# EAGLE design CtrlBoard (EAGLE 6.3)
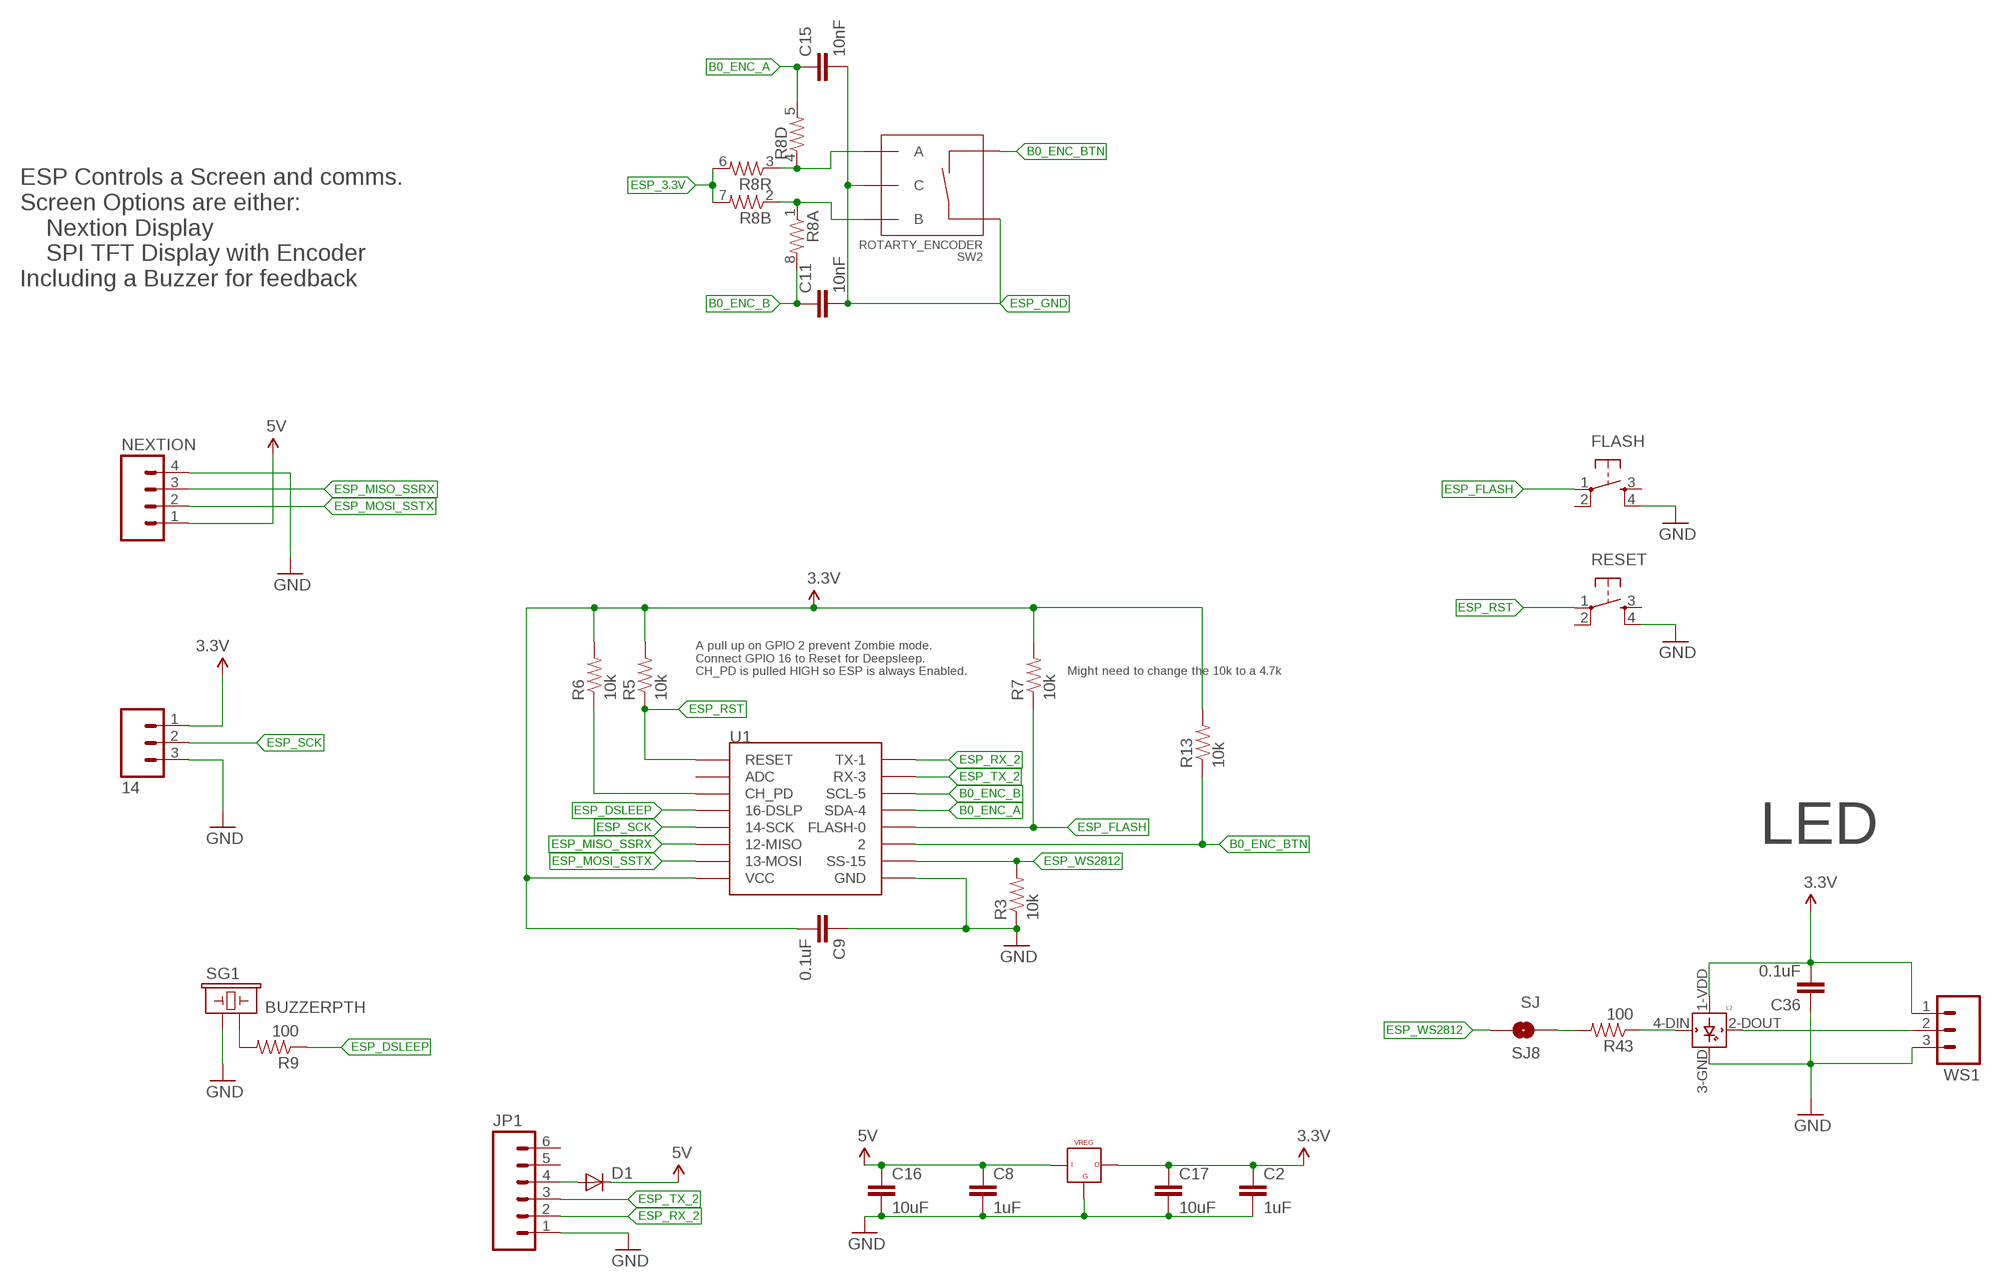
[diagram p0: schematic, sheet 1]

## Parts
14  M03PTH  [1X03]
C2  1uF  CAP0805  [0805]
C8  1uF  CAP0805  [0805]
C9  0.1uF  CAP0805  [0805]
C11  10nF  CAP0805  [0805]
C15  10nF  CAP0805  [0805]
C16  10uF  CAP0805  [0805]
C17  10uF  CAP0805  [0805]
C36  0.1uF  CAP0805  [0805]
D1  DIODESOD  [SOD-323]
FLASH  TAC_SWITCHSMD  [TACTILE_SWITCH_SMD]
JP1  M06SILK_FEMALE_PTH  [1X06]
L2  WS2812B  [WS2812B]
NEXTION  M041X04_NO_SILK  [1X04_NO_SILK]
R3  10k  RESISTOR0805  [0805]
R5  10k  RESISTOR0805  [0805]
R6  10k  RESISTOR0805  [0805]
R7  10k  RESISTOR0805  [0805]
R8  RESISTOR-ARRAY0603-ARV  [0603-ARV]
R9  100  RESISTOR0805  [0805]
R13  10k  RESISTOR0805  [0805]
R43  100  RESISTOR0805  [0805]
RESET  TAC_SWITCHSMD  [TACTILE_SWITCH_SMD]
SG1  BUZZERPTH  [BUZZER-12MM]
SJ8  SJ  SOLDERJUMPERNO  [SJ_2S-NO]
SW2  ROTARTY_ENCODER  [ROTARY_ENC_PLAIN]
U1  ESP12SMD  [ESP12-SMD]
U$3  VREG_3V3  [DPACK]
WS1  M03PTH  [1X03]

## Nets
B0_ENC_A: C15.1 R8.5 U1.GPIO4(SDA-4)
B0_ENC_B: C11.1 R8.8 U1.GPIO5(SCL-5)
B0_ENC_BTN: R13.1 SW2.SW- U1.GPIO2
ESP_3.3V: 14.1 C2.1 C9.2 C17.1 C36.2 L2.1-VDD(VDD) R5.2 R6.2 R7.2 R8.6 R8.7 R13.2 U1.VCC U$3.2 WS1.1 ; supply symbol labelled 3.3V
ESP_5V: C8.1 C16.1 D1.1(C) NEXTION.1 U$3.3 ; supply symbol labelled 5V
ESP_DSLEEP: R9.1 U1.GPIO16(16-DSLP)
ESP_FLASH: FLASH.1 R7.1 U1.GPIO0(FLASH-0)
ESP_GND: 14.3 C2.2 C8.2 C9.1 C11.2 C15.2 C16.2 C17.2 C36.1 FLASH.4 JP1.1 L2.3-GND(GND) NEXTION.4 R3.1 RESET.4 SG1.+ SW2.C SW2.SW+ U1.GND U$3.1 WS1.3 ; supply symbol labelled GND
ESP_MISO_SSRX: NEXTION.3 U1.GPIO12(12-MISO)
ESP_MOSI_SSTX: NEXTION.2 U1.GPIO13(13-MOSI)
ESP_RST: R5.1 RESET.1 U1.RESET
ESP_RX_2: JP1.2 U1.TXD0(TX-1)
ESP_SCK: 14.2 U1.GPIO14(14-SCK)
ESP_TX_2: JP1.3 U1.RXD0(RX-3)
ESP_WS2812: R3.2 SJ8.2 U1.GPIO15(SS-15)
N$1: R6.1 U1.CH_PD
N$4: D1.2(A) JP1.4
N$5: R8.1 R8.2 SW2.B
N$6: R9.2 SG1.-
N$7: R8.3 R8.4 SW2.A
N$74: L2.4-DIN(DIN) R43.1
N$75: L2.2-DOUT(DOUT) WS1.2
N$76: R43.2 SJ8.1
Unconnected: FLASH.2 FLASH.3 JP1.5 JP1.6 RESET.2 RESET.3 U1.ADC

## Notes on the sheet
- ESP Controls a Screen and comms.
  Screen Options are either:
      Nextion Display
      SPI TFT Display with Encoder
  Including a Buzzer for feedback
- A pull up on GPIO 2 prevent Zombie mode.
  Connect GPIO 16 to Reset for Deepsleep.
  CH_PD is pulled HIGH so ESP is always Enabled.
- Might need to change the 10k to a 4.7k
- LED

## Library data of the parts
14 WS1 = SparkFun-Connectors:M03: Header 3 Standard 3-pin 0.1" header. Use with straight break away headers (SKU : PRT-00116), right angle break away headers (PRT-00553), swiss pins (PRT-00743), machine pins (PRT-00117), and female headers (PRT-00115). Molex polarized connector foot print use with SKU : PRT-08232 with associated crimp pins and housings.
C2 C8 C9 C11 C15-C17 C36 = SparkFun-Capacitors:CAP: Capacitor Standard 0603 ceramic capacitor, and 0.1" leaded capacitor.
D1 = SparkFun-DiscreteSemi:DIODE: Diode These are standard reverse protection diodes and small signal diodes. SMA package can handle up to about 1A. SOD-323 can handle about 200mA. What the SOD-323 package when ordering, there are some mfgs out there that are 5-pin packages.; PROD_ID: DIO-09646
FLASH RESET = SparkFun-Electromechanical:TAC_SWITCH: Momentary Switch Button commonly used for reset or general input. Spark Fun Electronics SKU : COM-00097 SMT- SWCH-08247; PROD_ID: SWCH-08247
JP1 = SparkFun-Connectors:M06: Header 6 Standard 6-pin 0.1" header. Use with straight break away headers (SKU : PRT-00116), right angle break away headers (PRT-00553), swiss pins (PRT-00743), machine pins (PRT-00117), and female headers (PRT-00115). Molex polarized connector foot print use with SKU : PRT-08094 with associated crimp pins and housings. NOTES ON THE VARIANTS LOCK and LOCK_LONGPADS... This footprint was designed to help hold the alignment of a through-hole component (i.e. 6-pin header) while soldering it into place. You may notice that each hole has been shifted either up or down by 0.005 of an inch from it's more standard position (which is a perfectly straight line). This slight alteration caused the pins (the squares in the middle) to touch the edges of the holes. Because they are alternating, it causes a "brace" to hold the component in place. 0.005 has proven to be the perfect amount of "off-center" position when using our standard breakaway headers. Although looks a little odd when you look at the bare footprint, once you have a header in there, the alteration is very hard to notice. Also,if you push a header all the way into place, it is covered up entirely on the bottom side. This idea of altering the position of holes to aid alignment will be further integrated into the Sparkfun Library for other footprints. It can help hold any component with 3 or more connection pins.; PROD_ID: CONN-08437
L2 = adafruit:WS2812B
NEXTION = SparkFun-Connectors:M04: Header 4 Standard 4-pin 0.1" header. Use with straight break away headers (SKU : PRT-00116), right angle break away headers (PRT-00553), swiss pins (PRT-00743), machine pins (PRT-00117), and female headers (PRT-00115). Molex polarized connector foot print use with SKU : PRT-08231 with associated crimp pins and housings. 1MM SMD Version SKU: PRT-10208
R3 R5-R7 R9 R13 R43 = LowPowerLab:RESISTOR: Resistor Basic schematic elements and footprints for 0603, 1206, and PTH resistors.
R8 = SparkFun-Resistors:RESISTOR-ARRAY: Array Chip Resistor Source: RS Component / Phycomp
SG1 = SparkFun-Electromechanical:BUZZER: Buzzer 12mm Spark Fun Electronics SKU : Comp-Buzzer
SJ8 = SparkFun-Passives:SOLDERJUMPER: Solder Jumper Standard SMD solder jumper. Used to automate production. Two varients : Normally Open and Normally Closed are the same, but have different paste layers. NC will have a large amount of paste and should jumper during reflow.
SW2 = SparkFun-Electromechanical:ROTARTY_ENCODER: Simple no LED rotary encoder Example: COM-09117
U1 = esp8266modules:ESP12: ESP8266 Wifi module 12
U$3 = 11xSKIPS:VREG_3V3

## Board
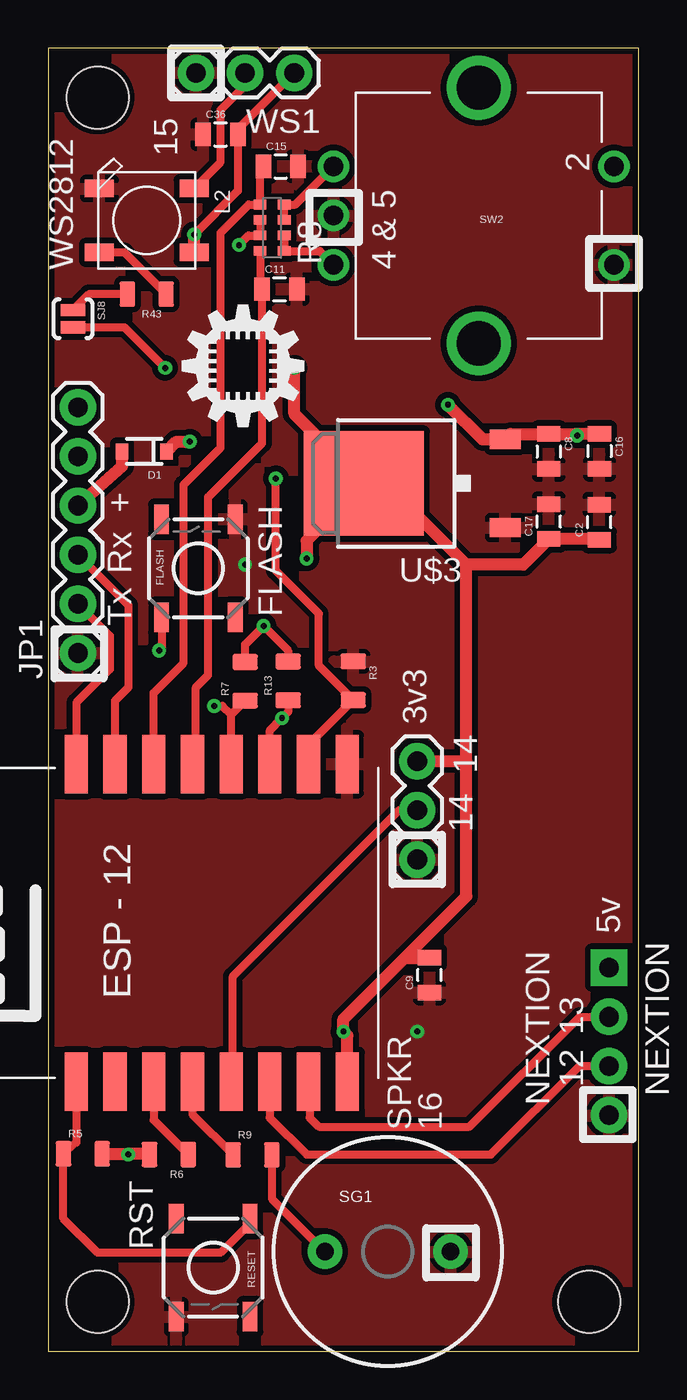
[diagram p1: board, top side]
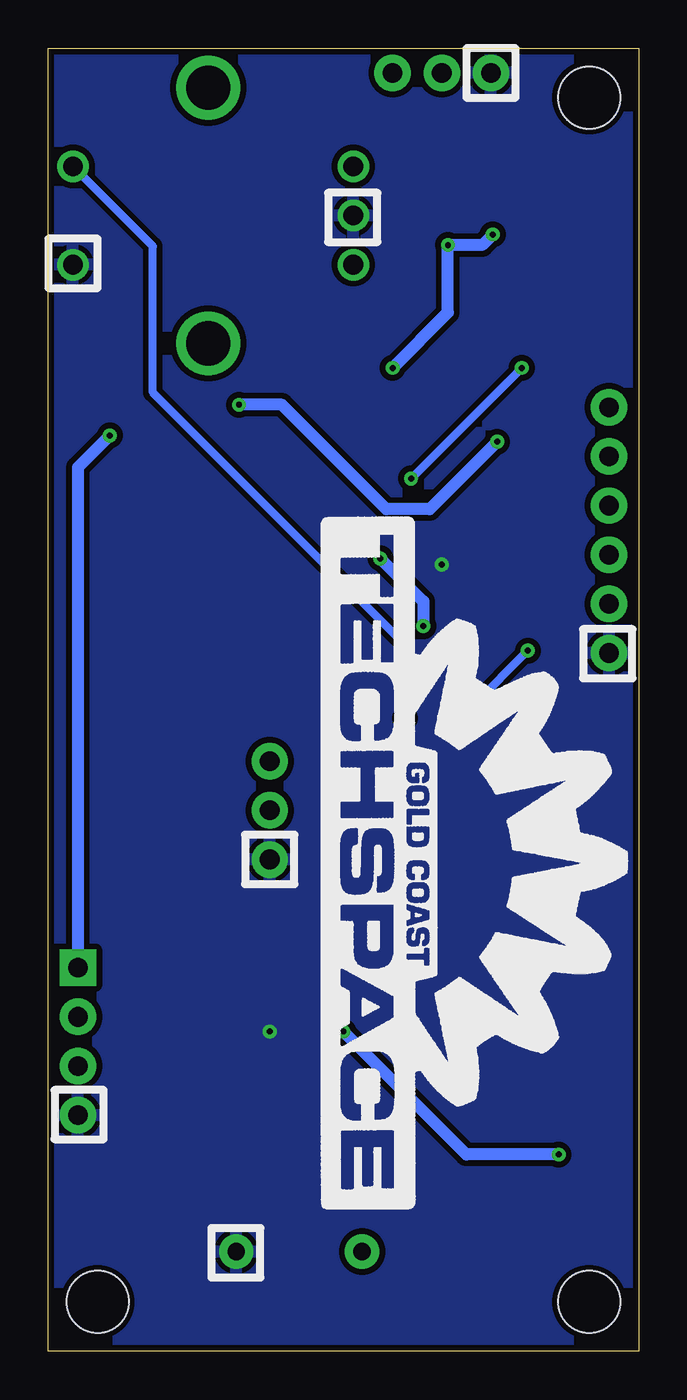
[diagram p2: board, bottom side, seen from below]

Size 30.48 x 67.31 mm. Coordinates in mm from the lower left corner, seen from the top.
Outline: 0,0 30.48,0 30.48,67.31 0,67.31 0,0
Copper layers (1*16): Top 0.035mm / dielectric 1.5mm / Bottom 0.035mm
Design rules "DFRobot_Eagle_Rule_v0.4": minimum track width 6mil, minimum drill 12mil, track to track 6mil, track to pad 6mil, pad to pad 6mil, via to via 6mil, smd to smd 0mil, copper to edge 10mil, drill to drill 10mil, minimum pad ring 12mil, minimum via ring 8mil, stop-mask expansion 2mil, vias tented up to drill 25mil, thermal gap 10mil
Holes 3.2 mm at 2.54,2.54 2.54,64.77 27.94,2.54

### Footprints (pad centres in the part's own frame; a part is rotated, then mirrored left to right if it is on the bottom)
1X03 = drill 1.016 pad 1.88: 1 0,0; 2 2.54,0; 3 5.08,0
0805 = smd 0.8 x 1.2: 1 -0.9,0; 2 0.9,0
SOD-323 = smd 0.63 x 0.83: 1 -1.15,0; 2 1.15,0
TACTILE_SWITCH_SMD = smd 1.524 x 0.762: 1 -2.54,1.905; 2 2.54,1.905; 3 -2.54,-1.905; 4 2.54,-1.905
1X06 = drill 1.016 pad 1.88: 1 0,0; 2 2.54,0; 3 5.08,0; 4 7.62,0; 5 10.16,0; 6 12.7,0
WS2812B = smd 1.5 x 0.9: 1-VDD 2.45,-1.65; 2-DOUT 2.45,1.65; 3-GND -2.45,1.65; 4-DIN -2.45,-1.65
1X04_NO_SILK = drill 1.016 pad 1.88 square: 1 0,0 | drill 1.016 pad 1.88: 2 2.54,0; 3 5.08,0; 4 7.62,0
0805' = smd 0.8 x 1.3: 1 -1,0; 2 1,0
0603-ARV = smd 0.5 x 0.65: 1 -1.2,-0.625; 2 -0.4,-0.625; 3 0.4,-0.625; 4 1.2,-0.625; 5 1.2,0.625; 6 0.4,0.625; 7 -0.4,0.625; 8 -1.2,0.625
BUZZER-12MM = drill 0.9 pad 1.778: + 3.25,0; - -3.25,0
SJ_2S-NO = smd 0.635 x 1.27: 1 -0.45,0; 2 0.45,0
ROTARY_ENC_PLAIN = drill 1.016: A 7.493,-2.54; B 7.493,2.54; C 7.493,0; SW+ -6.985,2.54; SW- -6.985,-2.54 | drill 2.286: P$3 0,6.604; P$4 0,-6.604
ESP12-SMD = smd 3 x 1.2: ADC -8.3,3.8; CH_PD -8.3,1.8; GND 8.1,-8.2; GPIO0 8.1,-2.2; GPIO2 8.1,-4.2; GPIO4 8.1,1.8; GPIO5 8.1,-0.2; GPIO12 -8.3,-4.2; GPIO13 -8.3,-6.2; GPIO14 -8.3,-2.2; GPIO15 8.1,-6.2; GPIO16 -8.3,-0.2; RESET -8.3,5.8; RXD0 8.1,3.8; TXD0 8.1,5.8; VCC -8.3,-8.2
DPACK = smd 1 x 1.6: 1 -2.28,-4.8; 3 2.28,-4.8 | smd 5.4 x 6.2: 2 0,2.5

### Placement (x,y rotation side)
14  19.05,30.48 270 top
C2  28.45,42.83 90 top
C8  25.84,46.48 270 top
C9  19.68,19.43 90 top
C11  11.94,54.86 0 top
C15  12,61.21 0 top
C16  28.46,46.49 270 top
C17  25.84,42.86 90 top
C36  8.89,62.87 0 top
D1  4.95,46.48 180 top
FLASH  7.75,40.45 90 top
JP1  1.52,36.07 90 top
L2  5.08,58.42 0 top
NEXTION  28.96,19.81 270 top
R3  10k  [0805']  15.75,34.64 270 top
R5  10k  [0805']  1.78,10.2 0 top
R6  10k  [0805']  6.22,10.16 180 top
R7  10k  [0805']  10.16,34.61 90 top
R8  11.56,58.04 90 top
R9  100  [0805']  10.54,10.14 0 top
R13  10k  [0805']  12.38,34.63 90 top
R43  100  [0805']  5.08,54.61 180 top
RESET  8.51,4.32 270 top
SG1  17.53,5.14 0 top
SJ8  1.27,53.34 270 top
SW2  22.23,58.67 180 top
U1  7.24,22.23 90 top
U$3  18.8,44.83 90 top
U$19  [GCTS_X0.75]  16.51,43.18 270 bottom
U$25  [ID_LOGO_X0.25]  6.83,47.62 0 top
WS1  12.7,66.04 180 top

### Tracks (layer width: path | path; a pad name or v marks a point on that pad's centre or on a via)
B0_ENC_A
  Top 0.406: C15.1 10.93,61.04 R8.5 10.34,59.24 8.89,57.78 8.89,46.67 6.99,44.77 6.99,35.56 5.44,34.01 U1.GPIO4
B0_ENC_B
  Top 0.406: R8.8 10.93,54.97 C11.1 11.04,46.92 8.26,44.13 8.26,34.92 7.62,34.29 7.62,30.51 U1.GPIO5
B0_ENC_BTN  (via drill 0.3)
  Top 0.406: U1.GPIO2 11.44,32.08 v12.06,32.7 12.38,33.02 R13.1
  Bottom 0.406: v12.06,32.7 12.06,36.51 25.08,49.53 25.08,57.09 SW2.SW-
ESP_3.3V  (via drill 0.3)
  Top 0.406: R8.6 R8.7 10.33,57.64 v9.84,57.15 | v7.53,57.7 9.79,59.95 C36.2 9.79,63.13 WS1.1 | C9.2 | 5.18,10.2 R6.2 | R13.2 12.38,36.2 v11.11,37.47 10.16,36.51 R7.2
  Top 0.61: L2.1-VDD v7.53,57.7 | 18.41,20.32 15.24,17.14 v15.24,16.51 15.44,16.31 U1.VCC | 18.41,20.32 C9.2 | U$3.2 12.7,48.43 v12.7,50.8 | C2.1 28.42,41.96 C17.1 24.52,40.64 21.59,40.64 | U$3.2 13.34,41.87 v13.34,40.96 | R5.2 4.09,10.2 v4.13,10.16 4.17,10.2 5.18,10.2 | 21.59,40.64 17.4,44.83 U$3.2 | 18.41,20.32 21.59,23.5 21.59,30.48 | 21.59,30.48 21.59,40.64 | 14.1 21.59,30.48
  Bottom 0.61: v7.53,57.7 8.07,57.15 v9.84,57.15 9.84,53.66 v12.7,50.8 | v13.34,40.96 11.11,38.73 v11.11,37.47 | v4.13,10.16 8.89,10.16 v15.24,16.51
ESP_5V  (via drill 0.3)
  Top 0.61: D1.1 6.61,46.99 v7.3,46.99 | v20.64,48.9 22.42,47.11 U$3.3 23.87,47.38 C8.1 25.86,47.39 27.22,47.39 v27.3,47.31 27.39,47.39 C16.1
  Bottom 0.61: v7.3,46.99 10.79,43.5 13.02,43.5 18.41,48.9 v20.64,48.9 | v27.3,47.31 28.96,45.66 NEXTION.1
ESP_DSLEEP
  Top 0.406: R9.1 7.44,12.24 U1.GPIO16
ESP_FLASH  (via drill 0.3)
  Top 0.406: U1.GPIO0 9.44,32.89 | 9.44,32.89 R7.1 | FLASH.1 5.84,36.32 v5.71,36.2 | v8.57,33.34 8.99,33.34 9.44,32.89
  Bottom 0.406: v5.71,36.2 v8.57,33.34
ESP_GND  (via drill 0.3)
  other vias: 19.05,16.51 10.16,40.64
  pour Bottom (isolate 0.305): 0,67.31 30.48,67.31 30.48,0 0,0
  pour Top (isolate 0.305): 0,67.31 30.48,67.31 30.48,0 0,0
ESP_MISO_SSRX
  Top 0.406: U1.GPIO12 11.43,13.92 11.43,12.06 13.34,10.16 22.86,10.16 27.43,14.73 NEXTION.3
ESP_MOSI_SSTX
  Top 0.406: U1.GPIO13 13.49,13.87 13.49,12.06 13.97,11.59 21.75,11.59 27.43,17.27 NEXTION.2
ESP_RST
  Top 0.406: U1.RESET 1.44,10.79 R5.1 0.78,6.84 2.54,5.08 8.89,5.08 10.41,6.6 RESET.1
ESP_RX_2
  Top 0.406: JP1.2 3.17,36.96 3.17,35.24 1.44,33.51 U1.TXD0
ESP_SCK
  Top 0.406: U1.GPIO14 9.53,14.01 9.53,19.37 18.1,27.94 14.2
ESP_TX_2
  Top 0.406: JP1.3 4.13,38.54 4.13,34.29 3.44,33.6 U1.RXD0
ESP_WS2812  (via drill 0.3)
  Top 0.406: U1.GPIO15 13.44,31.33 R3.2 13.97,35.42 13.97,38.1 11.75,40.32 v11.75,45.09 | v6.03,50.8 3.94,52.89 SJ8.2
  Bottom 0.406: v11.75,45.09 v6.03,50.8
N$1
  Top 0.406: U1.CH_PD 5.44,11.94 R6.1
N$4
  Top 0.406: D1.2
  Top 0.61: JP1.4 3.81,45.72 D1.2
N$5
  Top 0.406: R8.2 R8.1 14.03,56.84 SW2.B
N$6
  Top 0.406: R9.2 11.54,7.88 SG1.-
N$7
  Top 0.406: R8.3 R8.4 12.76,59.24 SW2.A
N$74
  Top 0.406: L2.4-DIN 3.92,56.77 R43.1
N$75
  Top 0.406: 7.62,60.16 L2.2-DOUT 8.89,61.43 8.89,64.14 10.16,65.41 WS1.2
N$76
  Top 0.406: R43.2 2.09,54.61 SJ8.1

### Text on the board
tPlace: 15 | 2 | WS2812 | 4 & 5 | + | Rx | FLASH | Tx | 3v3 | 14 | 5v | 13 | 12 | NEXTION | SPKR | 16 | RST